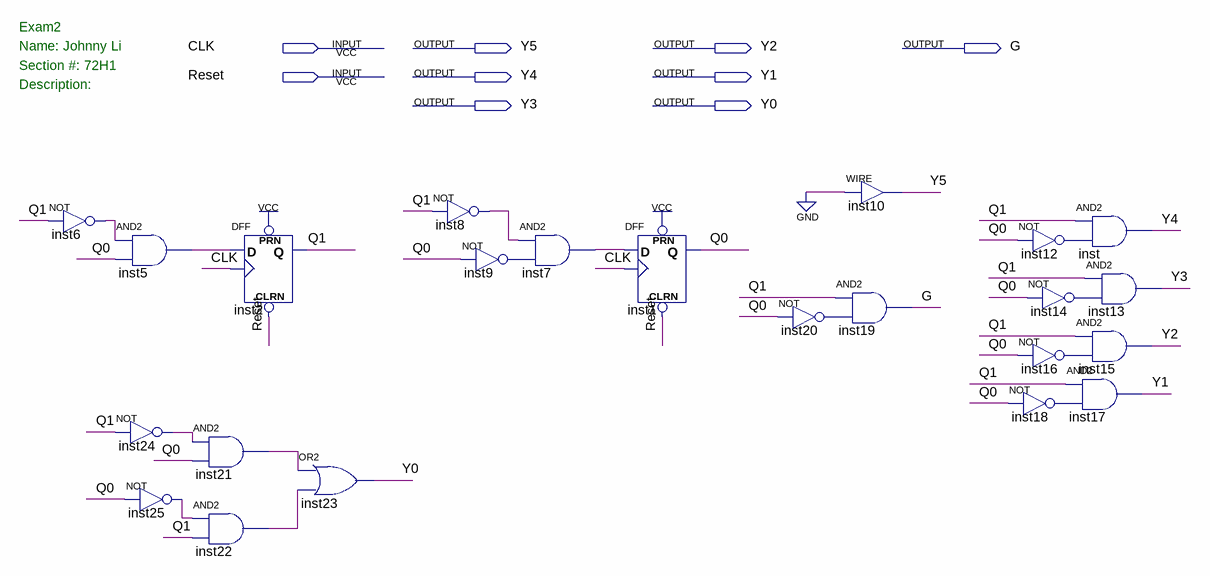
[diagram p0: schematic sheet]
// Quartus schematic Exam2.bdf as structural Verilog: 23 symbols, 9 pins
module Exam2 (
  input  CLK,
  input  Reset,
  output Y5,
  output Y2,
  output G,
  output Y4,
  output Y1,
  output Y3,
  output Y0
);

  wire inst5_out, inst6_out, inst7_out, inst8_out, inst9_out, inst12_out, inst14_out, inst16_out, inst18_out,
       inst20_out, inst21_out, inst22_out, inst24_out, inst25_out, Q0, Q1;

  not inst6 (inst6_out, Q1);
  and inst5 (inst5_out, inst6_out, Q0);
  not inst24 (inst24_out, Q1);
  not inst25 (inst25_out, Q0);
  DFF inst2 (.CLRN(Reset), .CLK(CLK), .D(inst5_out), .PRN(1'b1), .Q(Q1));
  and inst21 (inst21_out, inst24_out, Q0);
  and inst22 (inst22_out, inst25_out, Q1);
  or inst23 (Y0, inst21_out, inst22_out);
  not inst8 (inst8_out, Q1);
  not inst9 (inst9_out, Q0);
  and inst7 (inst7_out, inst8_out, inst9_out);
  DFF inst1 (.CLRN(Reset), .CLK(CLK), .D(inst7_out), .PRN(1'b1), .Q(Q0));
  not inst20 (inst20_out, Q0);
  assign Y5 = 1'b0;  // WIRE inst10
  and inst19 (G, Q1, inst20_out);
  not inst12 (inst12_out, Q0);
  not inst16 (inst16_out, Q0);
  not inst18 (inst18_out, Q0);
  and inst (Y4, Q1, inst12_out);
  and inst13 (Y3, Q1, inst14_out);
  not inst14 (inst14_out, Q0);
  and inst15 (Y2, Q1, inst16_out);
  and inst17 (Y1, Q1, inst18_out);

  // Notes on the sheet:
  //   Exam2
  //   Name: Johnny Li
  //   Section #: 72H1
  //   Description: 
endmodule
